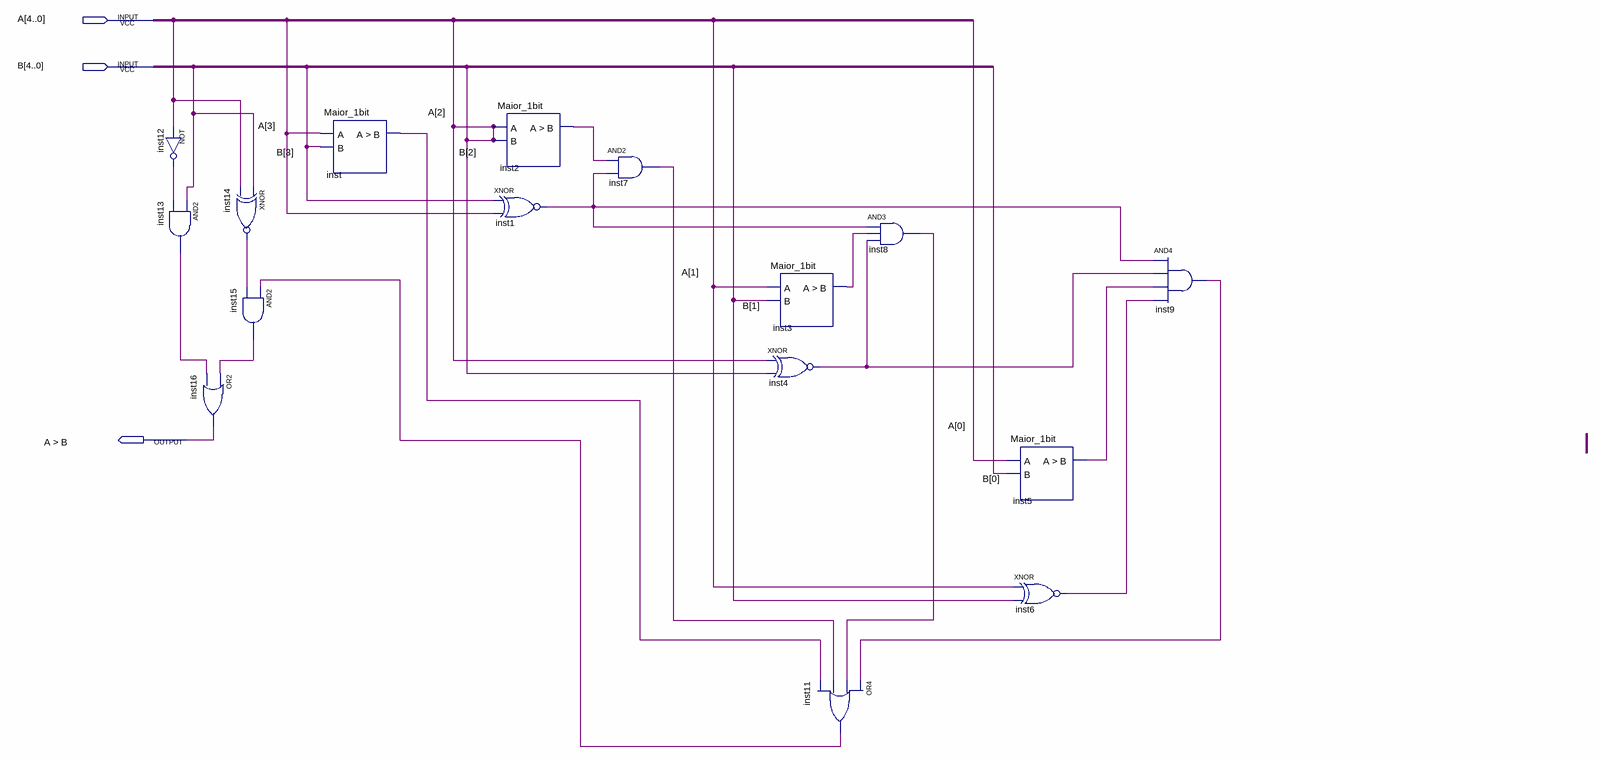
[diagram p0: schematic sheet]
// Quartus schematic Maior_5bits.bdf as structural Verilog: 16 symbols, 3 pins
module Maior_5bits (
  input  [4:0] A,
  input  [4:0] B,
  output \A_>_B 
);

  wire inst1_out, inst2_a___b, inst3_a___b, inst4_out, inst5_a___b, inst6_out, inst7_out, inst8_out,
       inst9_out, inst11_out, inst12_out, inst13_out, inst14_out, inst15_out, inst_a___b, undriven,
       undriven_2;

  not inst12 (inst12_out, undriven);
  and inst13 (inst13_out, undriven_2, inst12_out);
  xnor inst14 (inst14_out, undriven_2, undriven);
  and inst15 (inst15_out, inst11_out, inst14_out);
  or inst16 (\A_>_B , inst15_out, inst13_out);
  Maior_1bit inst (.A(A[3]), .B(B[3]), .\A_>_B (inst_a___b));
  Maior_1bit inst2 (.A(A[2]), .B(A[2]), .\A_>_B (inst2_a___b));
  xnor inst1 (inst1_out, B[3], A[3]);
  and inst7 (inst7_out, inst2_a___b, inst1_out);
  Maior_1bit inst3 (.A(A[1]), .B(B[1]), .\A_>_B (inst3_a___b));
  xnor inst4 (inst4_out, A[2], A[2]);
  or inst11 (inst11_out, inst9_out, inst8_out, inst7_out, inst_a___b);
  and inst8 (inst8_out, inst1_out, inst3_a___b, inst4_out);
  Maior_1bit inst5 (.A(A[0]), .B(B[0]), .\A_>_B (inst5_a___b));
  xnor inst6 (inst6_out, A[1], B[1]);
  and inst9 (inst9_out, inst1_out, inst4_out, inst5_a___b, inst6_out);

  assign B[2] = A[2];
endmodule
